# Altium schematic sheet StreamDeck_CPU1-V0.SchDoc: Alimentacion uC - Stream Deck
size A4; Author: Guido Glorioso; Revision: 0; SheetNumber: 3; SheetTotal: 5
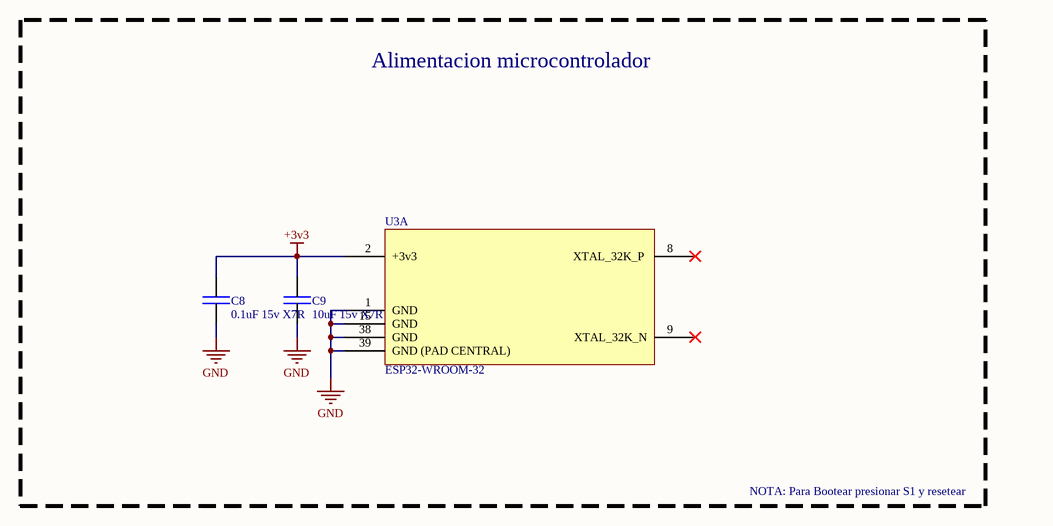
[diagram p0: StreamDeck_CPU1-V0.SchDoc]

## Parts
C8  0.1uF 15v X7R  [C_0805]
C9  10uF 15v X7R  [C_0805]
U3  ESP32-WROOM-32  [Espressif ESP32-WROOM-32]  (part A of 2)

## Blocks framed on the sheet
Alimentacion microcontrolador: C8 C9 U3

## Nets
+3v3: C8.1 C9.1 U3.2(+3v3)
GND: C8.2 C9.2 U3.1(GND) U3.15(GND) U3.38(GND) U3.39(GND_(PAD_CENTRAL))

Not connected (* = marked no-connect by the designer): U3 8(XTAL_32K_P_)* 9(XTAL_32K_N)*

## Notes on the sheet
- NOTA: Para Bootear presionar S1 y resetear
- Title:
- Size:
- Author:
- A4
- Sheet
- of
- Revision:
- File:
- Date:

## Library data of the parts
C8 C9 = Capacitor NP: Capacitor no polarizado
U3 = ESP32: Modulo Bluetooth/Wifi/Microcontrolador ESP32-WROOM-32 de EspressIf. 38 pines, SMD, con antena incluida.